# EAGLE design V3.82 - placa embutida rele smd (EAGLE 9.6.2)
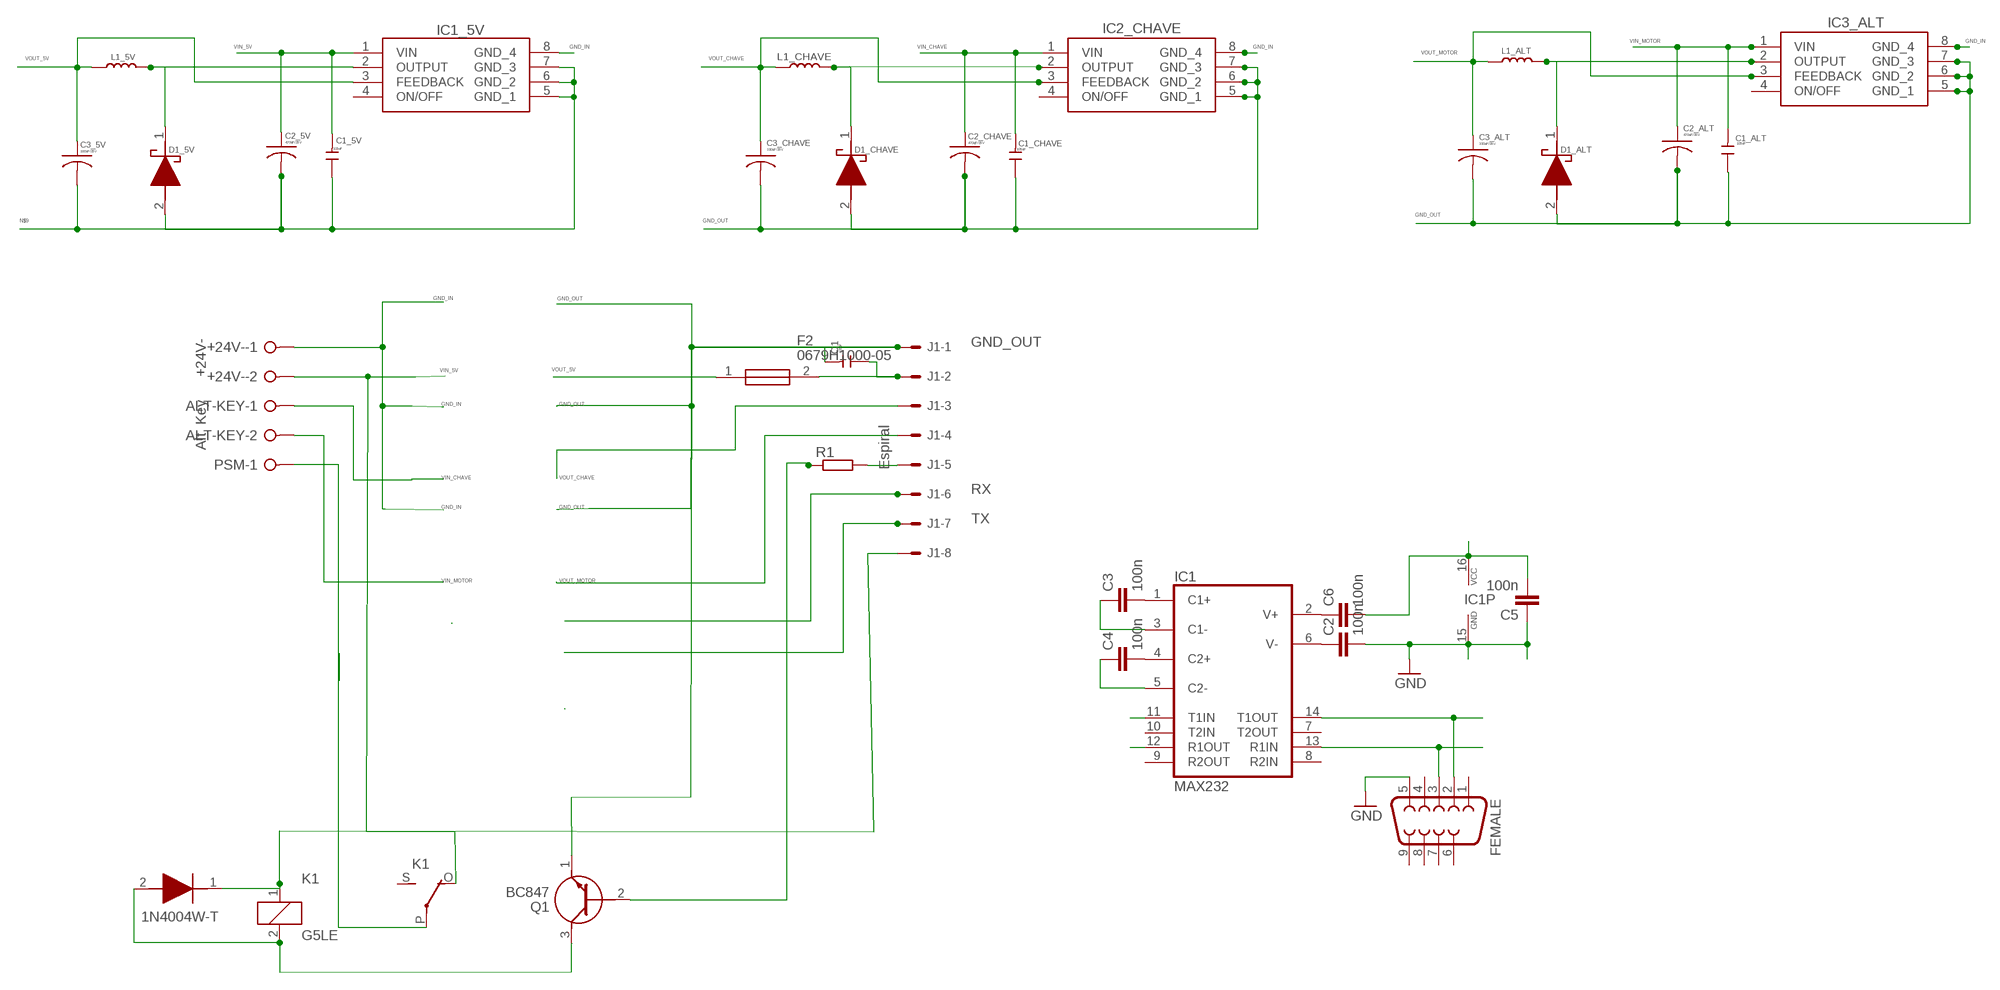
[diagram p0: schematic, sheet 1]

## Parts
+24V-  +24V-  W237-02P  [W237-132]
ALT-KEY  Alt Key  W237-02P  [W237-132]
C1  105uF  C-0805  [C0805]
C1_5V  105uF  C-0805  [C0805]
C1_ALT  105uF  C-0805  [C0805]
C1_CHAVE  105uF  C-0805  [C0805]
C2  100n  C-EUC0805  [C0805]
C2_5V  470uF/35V  C-USC0201  [C0201]
C2_ALT  470uF/35V  C-USC0201  [C0201]
C2_CHAVE  470uF/35V  C-USC0201  [C0201]
C3  100n  C-EUC0805  [C0805]
C3_5V  180uF/35V  C-USC0201  [C0201]
C3_ALT  330uF/35V  C-USC0201  [C0201]
C3_CHAVE  330uF/35V  C-USC0201  [C0201]
C4  100n  C-EUC0805  [C0805]
C5  100n  C-EUC0805  [C0805]
C6  100n  C-EUC0805  [C0805]
D1_5V  1N5819HW1-7-F  [SODFL3518X115N]
D1_ALT  1N5819HW1-7-F  [SODFL3518X115N]
D1_CHAVE  1N5819HW1-7-F  [SODFL3518X115N]
D2  1N4004W-T  [SODFL3818X130N]
F2  0679H1000-05  [FUSC6125X279N]
FEMALE  F09H  [F09H]
IC1  MAX232  MAX232ECWES  [SO16]
IC1_5V  XL1509-5.0E1  [SOIC127P600X175-8N]
IC2_CHAVE  XL1509-3.3E1  [SOIC127P600X175-8N]
IC3_ALT  XL1509-3.3E1  [SOIC127P600X175-8N]
J1  Espiral  22-05-7088-08  [7395-08]
K1  G5LE  [G5LE]
L1_5V  68uH  L'PIO73'  [PIO73]
L1_ALT  47uH  L'PIO73'  [PIO73]
L1_CHAVE  47uH  L'PIO73'  [PIO73]
PSM  PSM  W237-02P  [W237-132]
Q1  BC847  [BC847]
R1  SMR-WAV  [SMS-WAV]

## Nets
5V: C5.2 C6.2 IC1.16(VCC)
GND: C2.2 C5.1 FEMALE.5 IC1.15(GND)
GND_IN: +24V-.1 IC1_5V.8(GND_4) IC2_CHAVE.8(GND_4) IC3_ALT.8(GND_4)
GND_OUT: C1.2 C1_ALT.1 C1_CHAVE.1 C2_ALT.2 C2_CHAVE.2 C3_ALT.2 C3_CHAVE.2 D1_ALT.2(A) D1_CHAVE.2(A) IC2_CHAVE.5(GND_1) IC2_CHAVE.6(GND_2) IC2_CHAVE.7(GND_3) IC3_ALT.5(GND_1) IC3_ALT.6(GND_2) IC3_ALT.7(GND_3) J1.1 Q1.1(E)
N$1: D1_CHAVE.1(K) IC2_CHAVE.2(OUTPUT) L1_CHAVE.1
N$2: D1_5V.1(K) IC1_5V.2(OUTPUT) L1_5V.1
N$3: D1_ALT.1(K) IC3_ALT.2(OUTPUT) L1_ALT.1
N$6: J1.5 R1.1
N$7: Q1.2(B) R1.2
N$9: C1_5V.1 C2_5V.2 C3_5V.2 D1_5V.2(A) IC1_5V.5(GND_1) IC1_5V.6(GND_2) IC1_5V.7(GND_3)
N$10: C3.2 IC1.1(C1+)
N$11: C1.1 F2.2 J1.2
N$12: C4.2 IC1.4(C2+)
N$13: C3.1 IC1.3(C1-)
N$14: C4.1 IC1.5(C2-)
N$15: C6.1 IC1.2(V+)
N$16: C2.1 IC1.6(V-)
N$19: FEMALE.2 IC1.14(T1OUT)
N$20: FEMALE.3 IC1.13(R1IN)
N$38: D2.2(A) K1.2 Q1.3(C)
N$39: D2.1(K) J1.8 K1.1
N$40: K1.P(2:P) PSM.1
RX: IC1.12(R1OUT) J1.6
TX: IC1.11(T1IN) J1.7
VIN_5V: +24V-.2 C1_5V.2 C2_5V.1 IC1_5V.1(VIN) K1.O(2:O)
VIN_CHAVE: ALT-KEY.1 C1_CHAVE.2 C2_CHAVE.1 IC2_CHAVE.1(VIN)
VIN_MOTOR: ALT-KEY.2 C1_ALT.2 C2_ALT.1 IC3_ALT.1(VIN)
VOUT_5V: C3_5V.1 F2.1 IC1_5V.3(FEEDBACK) L1_5V.2
VOUT_CHAVE: C3_CHAVE.1 IC2_CHAVE.3(FEEDBACK) J1.3 L1_CHAVE.2
VOUT_MOTOR: C3_ALT.1 IC3_ALT.3(FEEDBACK) J1.4 L1_ALT.2
Unconnected: FEMALE.1 FEMALE.4 FEMALE.6 FEMALE.7 FEMALE.8 FEMALE.9 IC1.7(T2OUT) IC1.8(R2IN) IC1.9(R2OUT) IC1.10(T2IN) IC1_5V.4(ON/OFF) IC2_CHAVE.4(ON/OFF) IC3_ALT.4(ON/OFF) K1.S(2:S) PSM.2

## Library data of the parts
+24V- ALT-KEY PSM = con-wago-508:W237-02P: WAGO SREW CLAMP; OC_FARNELL: unknown; OC_NEWARK: unknown
C1 C1_5V C1_ALT C1_CHAVE = Discrete:C*: Ceramic Capacitors
C2-C6 = rcl:C-EU: CAPACITOR, European symbol
C2_5V C2_ALT C2_CHAVE C3_5V C3_ALT C3_CHAVE = rcl:C-US: CAPACITOR, American symbol; SPICEPREFIX: C
D1_5V D1_ALT D1_CHAVE = 1N5819HW1-7-F:1N5819HW1-7-F: 1N5819 Schottky Diode 40V 1A SOD123F Source: Datasheet <https://www.diodes.com/assets/Datasheets/1N5819HW1.pdf>; ARROW_PART_NUMBER: 1N5819HW1-7-F; ARROW_PRICE-STOCK: https://www.arrow.com/en/products/1n5819hw1-7-f/diodes-incorporated?region=nac; DESCRIPTION: 1N5819 Schottky Diode 40V 1A SOD123F; HEIGHT: 1.15mm; MANUFACTURER_NAME: Diodes Inc.; MANUFACTURER_PART_NUMBER: 1N5819HW1-7-F; MOUSER_PART_NUMBER: 621-1N5819HW1-7-F; MOUSER_PRICE-STOCK: https://www.mouser.co.uk/ProductDetail/Diodes-Incorporated/1N5819HW1-7-F?qs=60RJRzIpcl9ACQG7Zn63jQ%3D%3D
D2 = 1N4004W-T:1N4004W-T: Rectifiers SOD-123,1A,400V,GP Source: Datasheet <https://www.mouser.mx/datasheet/2/345/1n4001w_1n4007w-2449105.pdf>; DESCRIPTION: Rectifiers SOD-123,1A,400V,GP; HEIGHT: 1.3mm; MANUFACTURER_NAME: Rectron; MANUFACTURER_PART_NUMBER: 1N4004W-T; MOUSER_PART_NUMBER: 583-1N4004W-T; MOUSER_PRICE-STOCK: https://www.mouser.co.uk/ProductDetail/Rectron/1N4004W-T?qs=QNEnbhJQKvYW6o2Wv4Vvaw%3D%3D
F2 = 0679H1000-05:0679H1000-05: Fuse Chip Fast Acting 1A 350V Solder Pad SMD 2410 Ceramic T/R Source: Datasheet <https://www.arrow.com/en/products/0679h1000-05/bel-group>; ARROW_PART_NUMBER: 0679H1000-05; ARROW_PRICE-STOCK: https://www.arrow.com/en/products/0679h1000-05/bel-group?region=nac; DESCRIPTION: Fuse Chip Fast Acting 1A 350V Solder Pad SMD 2410 Ceramic T/R; HEIGHT: 2.79mm; MANUFACTURER_NAME: Bel Circuit Protection; MANUFACTURER_PART_NUMBER: 0679H1000-05
FEMALE = con-subd:F09: SUB-D
IC1 = maxim-6b:MAX232ECWE: RS232 TRANSEIVER
IC1_5V = XL1509-5.0E1:XL1509-5.0E1: 2A 150KHz 40V Buck DC to DC Converter. Source: Datasheet <https://datasheet.lcsc.com/szlcsc/XLSEMI-XL1509-5-0E1_C61063.pdf>; DESCRIPTION: 2A 150KHz 40V Buck DC to DC Converter.; HEIGHT: 1.75mm; MANUFACTURER_NAME: XLSEMI; MANUFACTURER_PART_NUMBER: XL1509-5.0E1
IC2_CHAVE IC3_ALT = XL1509-3.3E1:XL1509-3.3E1: 40V 2A SOP-8_150mil DC-DC Converters RoHS Source: Datasheet <https://datasheet.lcsc.com/szlcsc/XLSEMI-XL1509-3-3E1_C74193.pdf>; DESCRIPTION: 40V 2A SOP-8_150mil DC-DC Converters RoHS; HEIGHT: 1.75mm; MANUFACTURER_NAME: XLSEMI; MANUFACTURER_PART_NUMBER: XL1509-3.3E1
J1 = con-molex:22-?-08: CONNECTOR wire to board 2.54 mm (.1 inch) pitch header; MF: MOLEX; OC_FARNELL: unknown; OC_NEWARK: unknown
K1 = relay:G5LE: RELAY 1 x switch, 10 A/120 V AC, 8 A/30 V DC, Omron; OC_FARNELL: unknown; OC_NEWARK: unknown
L1_5V L1_ALT L1_CHAVE = Discrete:L*
Q1 = BC847:BC847: Epitaxial Planar NPN transistor Source: Datasheet <https://datasheet.datasheetarchive.com/originals/distributors/Datasheets-16/DSA-311605.pdf>; DESCRIPTION: Epitaxial Planar NPN transistor; HEIGHT: 1.3mm; MANUFACTURER_NAME: KEC; MANUFACTURER_PART_NUMBER: BC847
R1 = resistor-shunt:SMR-WAV: SMD SHUNT RESISTOR; OC_FARNELL: unknown; OC_NEWARK: unknown

## Module LDR
Ports: 

### Library data of the parts

## Net classes
1 New Class: width 0.5 mm, drill 1 mm

## Board
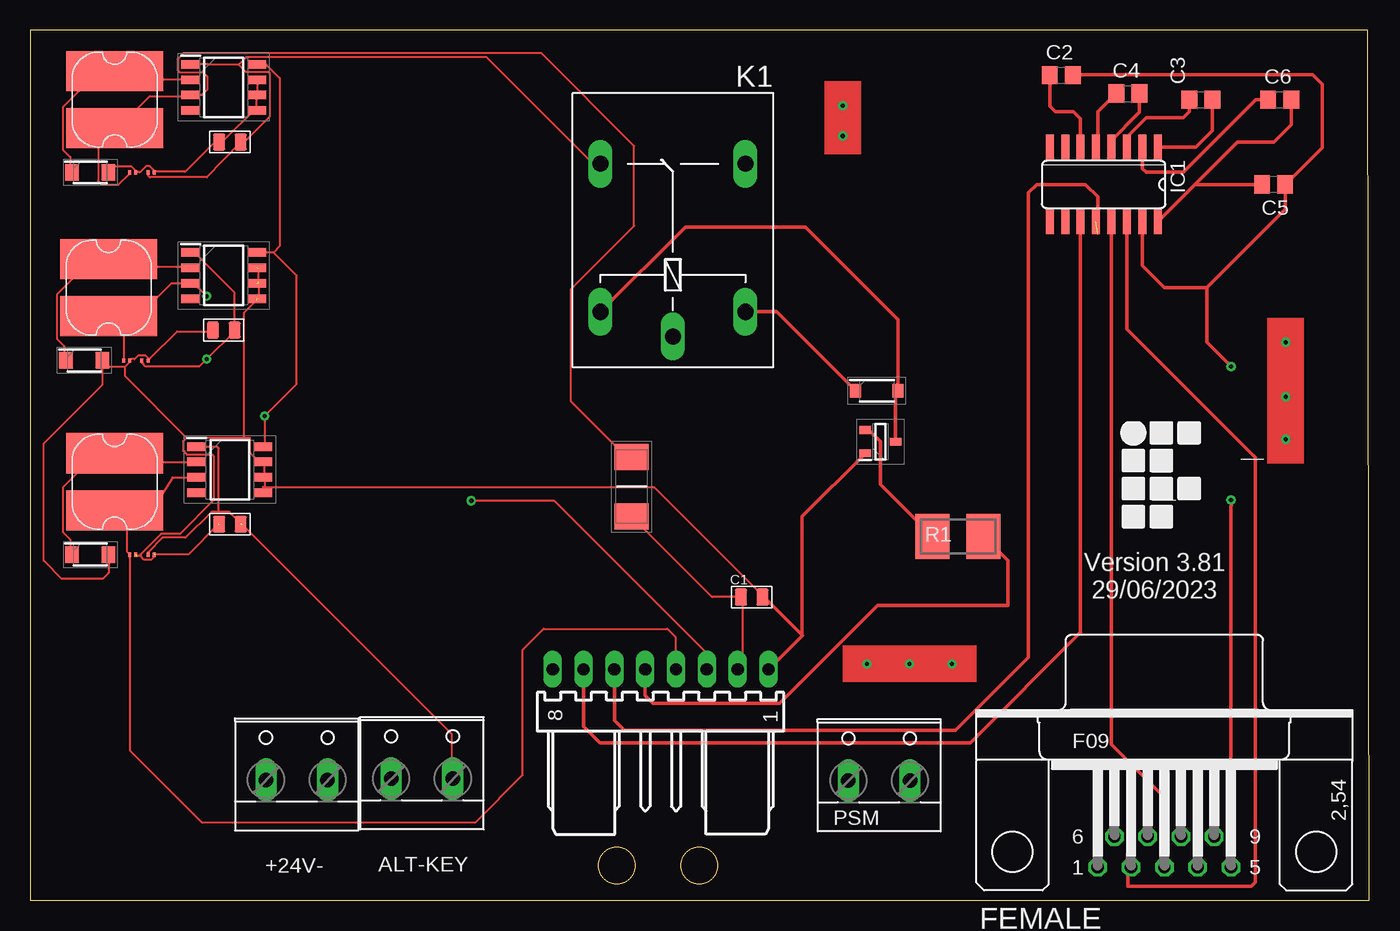
[diagram p1: board, top side]
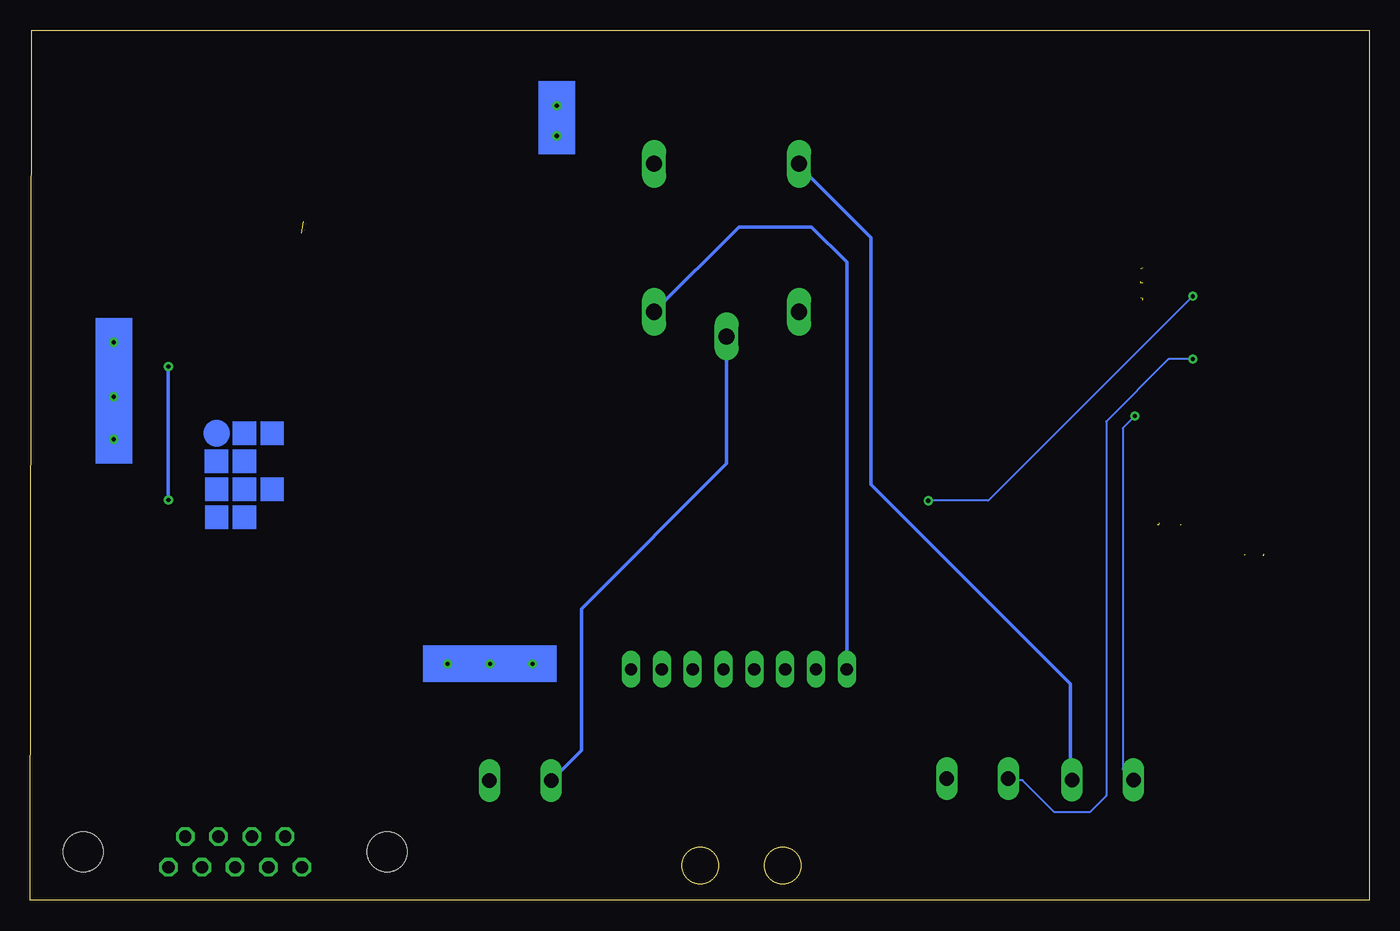
[diagram p2: board, bottom side, seen from below]

Size 110.32 x 71.7 mm. Coordinates in mm from the lower left corner, seen from the top.
Outline: 0,0 110.32,0 110.2,71.7 0,71.7 0,0
Outline: circle at 48.31,2.85 radius 1.5
Outline: circle at 55.11,2.85 radius 1.5
Copper layers (1*16): Top 0.035mm / dielectric 1.5mm / Bottom 0.035mm
Design rules "default *": minimum track width 6mil, minimum drill 0.35mm, track to track 6mil, track to pad 6mil, pad to pad 6mil, via to via 6mil, smd to smd 6mil, copper to edge 40mil, drill to drill 6mil, minimum pad ring 10mil, minimum via ring 8mil, stop-mask expansion 4mil, vias tented up to drill 0mil, thermal gap 10mil

### Footprints (pad centres in the part's own frame; a part is rotated, then mirrored left to right if it is on the bottom)
W237-132 = drill 1.194 long: 1 -2.54,-0.635; 2 2.54,-0.635
C0805 = smd 1.016 x 1.397: 1 -0.889,0; 2 0.889,0
C0805' = smd 1.3 x 1.5: 1 -0.95,0; 2 0.95,0
C0201 = smd 0.25 x 0.35: 1 -0.25,0; 2 0.25,0
SODFL3518X115N = smd 1.12 x 1.37: 1 -1.5,0; 2 1.5,0
SODFL3818X130N = smd 0.92 x 1.13: 1 -1.75,0; 2 1.75,0
FUSC6125X279N = smd 2.15 x 2.8: 1 -2.455,0; 2 2.455,0
F09H = drill 1.016 octagon: 1 -5.486,-1.27; 2 -2.743,-1.27; 3 0,-1.27; 4 2.743,-1.27; 5 5.486,-1.27; 6 -4.115,1.27; 7 -1.372,1.27; 8 1.372,1.27; 9 4.115,1.27 | hole 3.302: -12.522,0; 12.522,0
SO16 = smd 0.66 x 2.032: 1 -4.445,-3.073; 2 -3.175,-3.073; 3 -1.905,-3.073; 4 -0.635,-3.073; 5 0.635,-3.073; 6 1.905,-3.073; 7 3.175,-3.073; 8 4.445,-3.073; 9 4.445,3.073; 10 3.175,3.073; 11 1.905,3.073; 12 0.635,3.073; 13 -0.635,3.073; 14 -1.905,3.073; 15 -3.175,3.073; 16 -4.445,3.073
SOIC127P600X175-8N = smd 1.55 x 0.7: 1 -2.725,1.905; 2 -2.725,0.635; 3 -2.725,-0.635; 4 -2.725,-1.905; 5 2.725,-1.905; 6 2.725,-0.635; 7 2.725,0.635; 8 2.725,1.905
7395-08 = drill 1.016 long: 1 8.89,0; 2 6.35,0; 3 3.81,0; 4 1.27,0; 5 -1.27,0; 6 -3.81,0; 7 -6.35,0; 8 -8.89,0
G5LE = drill 1.321 long: 1 -7.493,-5.969; 2 -7.493,5.969; O 4.699,5.969; P -9.525,0; S 4.699,-5.969
PIO73 = smd 8 x 3.3: 1 0,2.35; 2 0,-2.35
BC847 = smd 0.95 x 0.65: 1 -1.25,-0.95; 2 -1.25,0.95; 3 1.25,0
SMS-WAV = smd 2.8 x 3.7: 1 2.108,0; 2 -2.108,0

### Placement (x,y rotation side)
+24V-  21.95,10.56 0 top
ALT-KEY  32.27,10.66 0 top
C1  59.44,24.99 0 top
C1_5V  16.44,62.49 0 top
C1_ALT  16.44,30.99 0 top
C1_CHAVE  15.94,46.99 0 top
C2  100n  [C0805']  84.94,67.99 0 top
C2_5V  9.94,59.99 0 top
C2_ALT  9.94,28.49 0 top
C2_CHAVE  9.44,44.49 0 top
C3  100n  [C0805']  96.44,65.99 0 top
C3_5V  8.44,59.99 0 top
C3_ALT  8.44,28.49 0 top
C3_CHAVE  7.94,44.49 0 top
C4  100n  [C0805']  90.44,66.49 0 top
C5  100n  [C0805']  102.44,58.99 180 top
C6  100n  [C0805']  102.94,65.99 0 top
D1_5V  4.94,59.99 0 top
D1_ALT  4.94,28.49 0 top
D1_CHAVE  4.44,44.49 0 top
D2  69.74,41.99 0 top
F2  49.54,34.09 270 top
FEMALE  93.44,3.99 0 top
IC1  88.44,58.99 180 top
IC1_5V  15.94,66.99 0 top
IC2_CHAVE  15.94,51.49 0 top
IC3_ALT  16.44,35.49 0 top
J1  51.93,19.03 0 top
K1  52.94,55.99 90 top
L1_5V  6.94,65.99 0 top
L1_ALT  6.94,34.49 0 top
L1_CHAVE  6.44,50.49 0 top
PSM  69.94,10.49 0 top
Q1  70.04,37.79 0 top
R1  76.44,29.99 0 top

### Tracks (layer width: path | path; a pad name or v marks a point on that pad's centre or on a via)
5V
  Top 0.305: C6.2 103.89,63.94 102.44,62.49 99.46,62.49 IC1.16 95.96,58.99 C5.2
GND  (via drill 0.35)
  Top 0.305: C2.2 85.95,68.05 105.67,68.05 106.44,67.28 106.44,62.04 C5.1 103.39,56.94 96.94,50.49 | 96.94,50.49 93.44,50.49 91.62,52.32 IC1.15 | FEMALE.5 98.93,32.48 98.94,32.49 v98.94,32.99 | v98.94,43.99 96.94,45.99 96.94,50.49
  Bottom 0.305: v98.94,32.99 v98.94,43.99
GND_IN  (via drill 0.35)
  Top 0.152: IC3_ALT.8 19.3,37.51 v19.3,39.92 21.94,42.57 21.94,51.49 20.04,53.4 | IC1_5V.8 18.69,68.88 19.45,68.88 20.56,67.77 20.56,53.92 20.04,53.4 | 20.04,53.4 IC2_CHAVE.8
  Bottom 0.152: v19.3,39.92 20.3,38.92 20.3,10.81 +24V-.1
GND_OUT  (8 unrouted)
  Top 0.152: 9.81,44.6 9.5,44.91 8.89,44.91 8.59,44.6 8.28,44.6 C3_CHAVE.2 8.13,44.45 8.13,44.3 7.83,44 | 7.83,44 6.45,44 6,44.45 D1_CHAVE.2 5.94,42.49 1.09,37.64 1.09,27.99 2.59,26.49 5.94,26.49 6.44,26.99 D1_ALT.2 | 9.81,44.6 12.09,46.89 14.99,46.89 C1_CHAVE.1 | 9.81,44.6 C2_CHAVE.2 | 9.09,28.36 8.78,28.36 | 9.09,28.36 9.39,28.06 9.94,28.06 10.19,28.31 C2_ALT.2 | 10.31,28.52 13.05,28.52 15.49,30.96 | 18.8,50.85 18.8,49.63 | 18.8,51.01 18.8,52.07 | 17.58,38.12 17.58,48.41 18.65,49.48 | 9.09,28.36 9.09,28.52 10.76,30.19 12.33,30.19 15.13,32.99 15.13,36.59 14.97,36.75 12.9,36.75 12.59,37.05 12.59,37.81 12.9,38.12 | 17.58,38.12 18.08,38.12 18.08,36.9 18.84,36.14 19.15,36.14 IC3_ALT.7 19.3,35.98 19.3,34.92 IC3_ALT.6 19.3,34.77 19.3,33.7 IC3_ALT.5 19.17,34.07 19.3,34.02 51.41,34.02 59.99,25.45 60.02,25.3 C1.2 60.44,24.99 | 17.58,38.12 12.9,38.12 | 7.83,44 7.83,43.19 12.9,38.12 | 63.61,21.82 63.59,21.84 63.49,21.94
  Top 0.305: 63.49,21.94 60.44,24.99 | J1.1 63.61,21.82 | 63.59,21.84 63.59,31.64 Q1.1
N$1
  Top 0.152: D1_CHAVE.1 2.8,44.6 2.8,45.67 2.19,46.28 2.19,49.94 5.08,52.83 6.3,52.83 L1_CHAVE.1 7.06,52.22 13.16,52.22 IC2_CHAVE.2
N$2
  Top 0.152: D1_5V.1 3.3,59.99 3.3,61.26 2.69,61.87 2.69,65.37 5.58,68.27 6.21,68.6 6.69,68.6 L1_5V.1 7.68,68.34 8.36,67.66 12.95,67.66 12.97,67.63 IC1_5V.2
N$3
  Top 0.152: D1_ALT.1 3.3,28.52 3.3,29.74 2.69,30.35 2.69,34 5.43,36.75 6.8,36.75 L1_ALT.1 6.95,36.75 7.56,36.14 13.66,36.14 IC3_ALT.2
N$6
  Top 0.305: J1.5 50.66,16.88 51.33,16.22 61.73,16.22 69.8,24.29 80.55,24.29 80.55,27.99 R1.1
N$7
  Top 0.305: R1.2 70.04,34.29 70.04,37.79 69.09,38.74 Q1.2
N$9
  Top 0.152: D1_5V.2 6.95,60.5 8.33,60.5 8.63,60.19 8.63,59.99 C3_5V.2 9,59.99 9.09,60.04 9.54,60.5 9.85,60.5 10.19,60.15 C2_5V.2 | IC1_5V.7 18.69,67.51 18.69,66.38 IC1_5V.6 IC1_5V.5 18.54,65.22 15.95,62.63 15.55,62.63 C1_5V.1 15.45,62.39 14.99,62.28 12.75,60.04 10.31,60.04
N$10
  Top 0.305: C3.2 97.39,63.44 96.02,62.07 IC1.1
N$11
  Top 0.152: C1.1 58.67,24.88 58.67,19.4 58.31,19.04 J1.2 | C1.1 58.51,24.99 | C1.1 56.19,24.99 F2.2
N$12
  Top 0.305: C4.2 91.39,64.94 88.94,62.49 88.94,62.2 IC1.4
N$13
  Top 0.305: C3.1 95.49,64.99 94.99,64.49 91.94,64.49 90.35,62.9 IC1.3
N$14
  Top 0.305: C4.1 89.44,66.49 87.94,64.99 87.94,62.2 IC1.5
N$15
  Top 0.305: C6.1 100.99,65.99 94.99,59.99 91.94,59.99 91.62,60.32 IC1.2
N$16
  Top 0.305: C2.1 83.99,65.44 84.44,64.99 85.94,64.99 86.54,64.4 IC1.6
N$19
  Top 0.305: IC1.14 90.35,47.09 100.94,36.49 100.94,1.49 100.62,1.17 90.44,1.17 90.44,2.47 FEMALE.2
N$20
  Top 0.305: IC1.13 89.08,12.86 93.44,8.49 FEMALE.3
N$21  (via drill 0.35)
  other vias: 68.94,19.49
N$22  (via drill 0.35)
  other vias: 75.94,19.49
N$23  (via drill 0.35)
  other vias: 72.44,19.49
N$24  (via drill 0.35)
  other vias: 103.44,45.99
N$25  (via drill 0.35)
  other vias: 103.44,37.99
N$26  (via drill 0.35)
  other vias: 103.44,41.49
N$30  (via drill 0.35)
  other vias: 66.94,65.49
N$31  (via drill 0.35)
  other vias: 66.94,62.99
N$38
  Top 0.305: K1.2 53.97,55.49 63.86,55.49 71.49,47.86 D2.2 71.29,41.79 Q1.3
N$39
  Top 0.305: D2.1 61.49,48.5 K1.1
  Bottom 0.305: K1.1 51.92,55.49 45.94,55.49 43.04,52.59 J1.8
N$40
  Bottom 0.305: PSM.1 64.9,12.36 64.9,24.03 52.94,35.99 K1.P
RX  (1 unrouted)
  Top 0.305: J1.6 48.12,14.82 48.94,13.99 76.23,13.99 82.26,20.02 82.26,58.31 82.94,58.99 86.94,58.99 87.94,57.99 87.94,54.99
  Bottom 0.61: J1.6 48.1,19.06
TX
  Top 0.305: J1.7 45.58,14.36 46.94,12.99 77.44,12.99 86.54,22.09 IC1.11
  Bottom 0.152: 45.66,19.35 J1.7
  Bottom 0.61: J1.7 45.55,19.07
VIN_5V
  Top 0.152: C2_5V.1 9.69,59.84 9.7,59.74 9.85,59.58 14.53,59.58 C1_5V.2 17.64,62.49 19.76,64.61 19.76,68.12 19.6,68.27 17.77,68.27 17.16,68.88 | 17.16,68.88 14.8,68.88 14.67,68.9 IC1_5V.1 | 17.16,68.88 17.77,69.49 37.58,69.49 | K1.O 46.37,60.69 37.58,69.49 | 37.58,69.49
  Bottom 0.152: K1.O 46.97,60.54 | 24.63,10.05 +24V-.2
  Bottom 0.305: 24.63,10.05 24.63,17.83 41.06,34.26 41.06,54.63 46.97,60.54
VIN_CHAVE  (via drill 0.35)
  Top 0.152: C2_CHAVE.1 9.2,44.45 9.2,44.3 9.5,44 13.92,44 v14.53,44.6 16.82,46.89 C1_CHAVE.2 16.82,47.04 16.82,50.09 13.62,53.29 13.31,53.29 IC2_CHAVE.1
  Bottom 0.152: v14.53,44.6 16.53,44.6 21.67,39.47 21.67,8.62 23.02,7.27 25.94,7.27 28.57,9.9 29.66,9.9 ALT-KEY.1
VIN_MOTOR  (2 unrouted)
  Top 0.152: 15.53,32.02 16.4,32.02 17.32,31.11 | 15.53,32.02 14.93,32.02 12.8,29.89 10.92,29.89 9.7,28.67 9.7,28.52 C2_ALT.1 | 15.53,32.02 15.53,37.25 15.42,37.36 13.81,37.36 IC3_ALT.1 | 17.47,30.96 34.69,13.73 34.69,10.05 ALT-KEY.2
VOUT_5V
  Top 0.152: C3_5V.1 8.19,59.91 7.26,58.97 5.89,58.97 5.58,59.28 5.58,62.33 6.9,63.64 L1_5V.2 7.2,63.64 9.84,66.29 13.29,66.29 IC1_5V.3 14.13,66.36 14.57,66.8 14.57,67.92 14.22,68.27 12.29,68.27 12.14,68.42 12.14,69.34 12.59,69.79 42.13,69.79 49.75,62.17 49.75,55.57 44.56,50.38 44.56,41.09 46.2,39.45 49.11,36.55
  Top 0.305: F2.1 49.11,36.55
VOUT_CHAVE  (via drill 0.35)
  Top 0.152: 7.67,46.89 7.67,44.6 C3_CHAVE.1 | 7.67,46.89 6.45,48.11 L1_CHAVE.2 7.67,46.89 | 7.67,46.89 11.64,50.85 13.16,50.85 IC2_CHAVE.3 13.31,51.01 v14.53,49.79 | J1.3 55.74,20.33 43.14,32.94 v36.33,32.94
  Bottom 0.152: v36.33,32.94 31.38,32.94 v14.53,49.79
VOUT_MOTOR
  Top 0.152: 8.67,31.3 8.9,31.53 | 8.9,31.53 10.85,33.48 11.72,34.86 IC3_ALT.3 | J1.4 53.2,21.67 52.5,22.37 42.3,22.37 40.58,20.65 40.58,10.33 36.67,6.42 14.12,6.42 8.19,12.34 C3_ALT.1 7.94,28.74 7.94,31.14 L1_ALT.2 7.55,31.53 8.9,31.53
  Top 0.61: J1.4 53.17,19
(copper drawn outside any net)
  shapes: Bottom area x12, Bottom circle x3, Top area x3

### Text on the board
tNames: Version 3.81 / 29/06/2023